# EAGLE design 1LD-15-mk-1.0 (EAGLE 7.5.0)
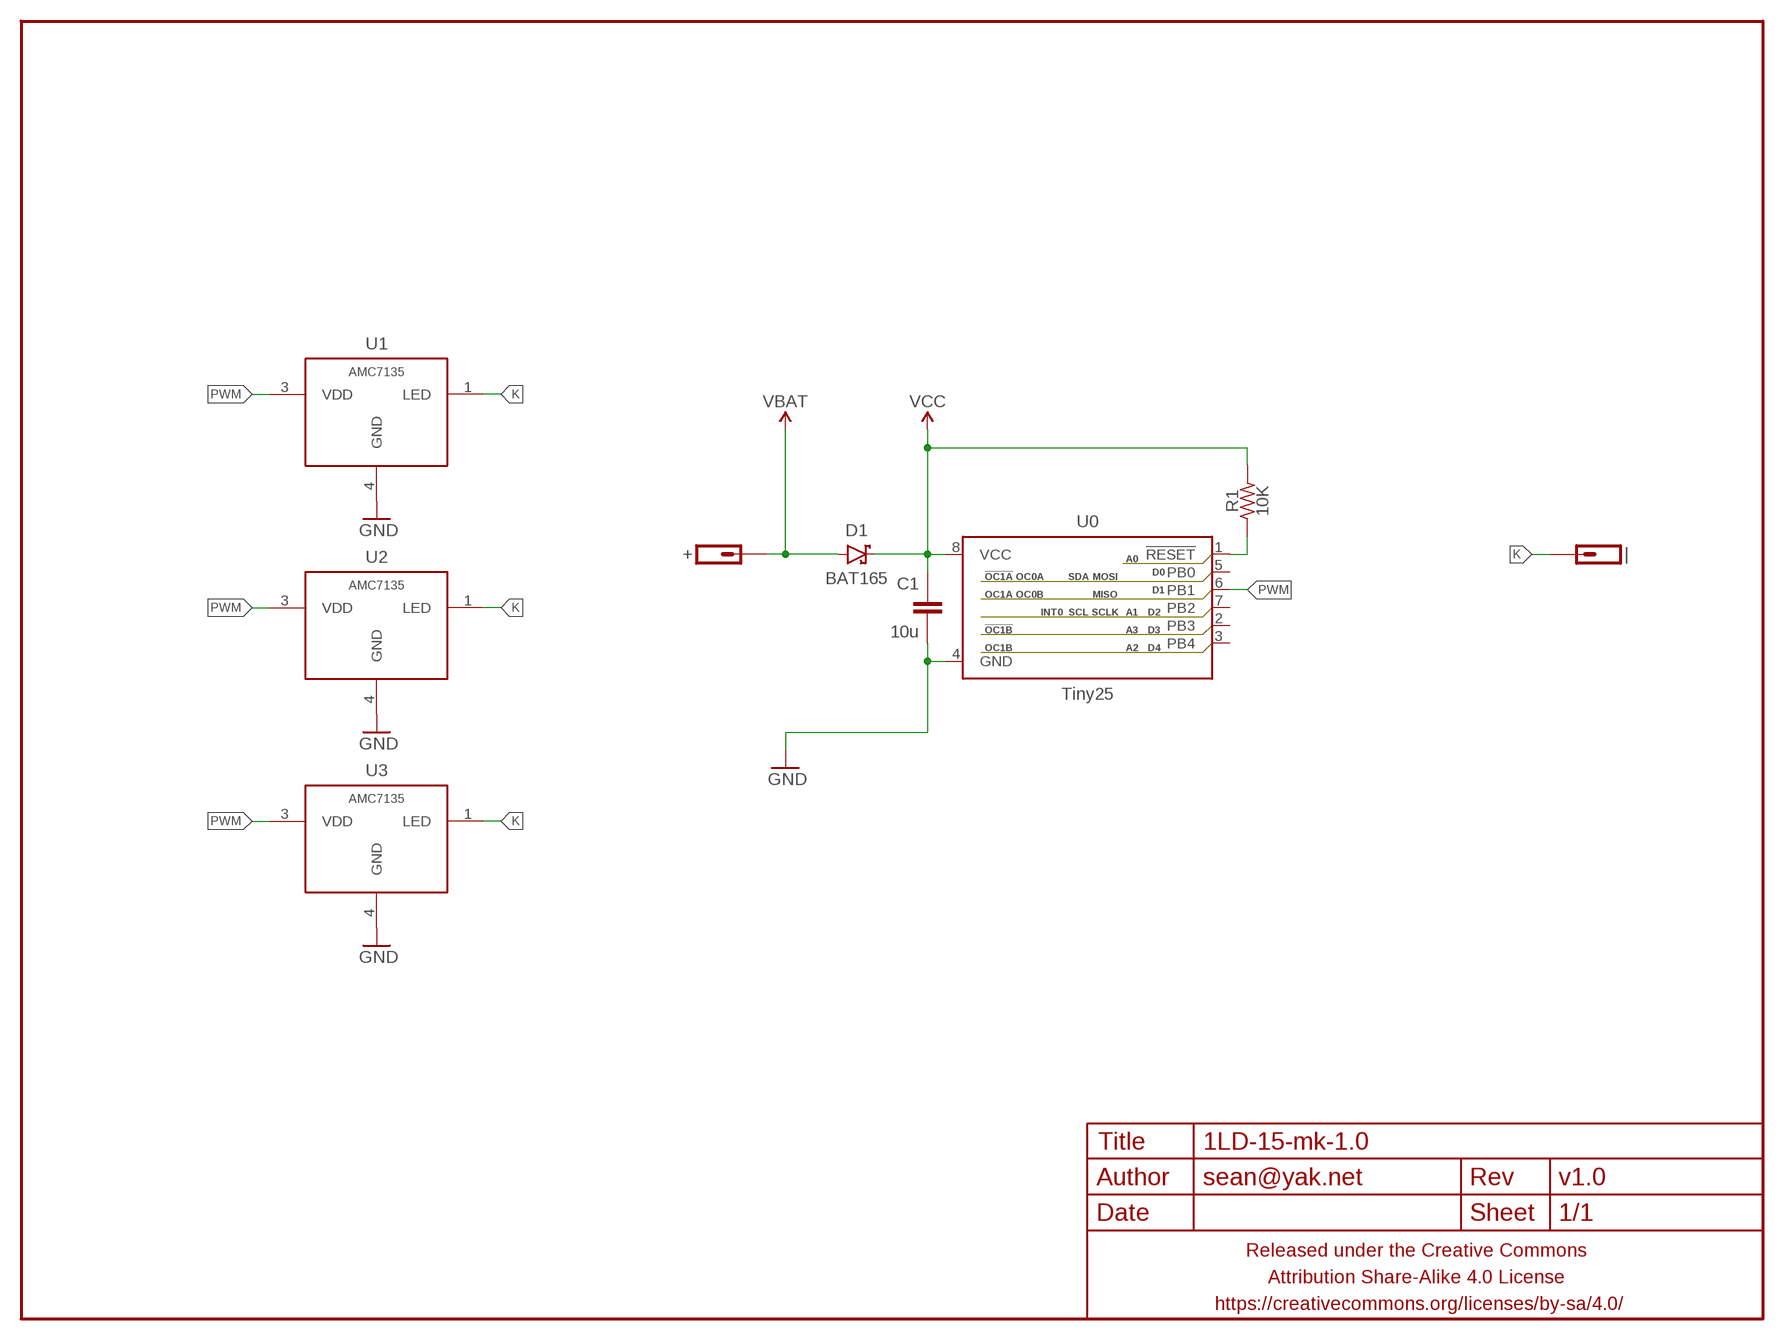
[diagram p0: schematic, sheet 1]

## Parts
+  M01PTH-0.8MM-CIR  [1X01-0.8MM-CIR]
C1  10u  CAPACITOR-CERAMICC0603-TIGHTER  [C0603-TIGHTER]
D1  BAT165  DIODE-SCHOTTKYSOD123-ROUNDED  [SOD-123-SCHOTTYK-ROUND]
FRAME1  FRAME-LETTERNO_PACKAGE  [DUMMY]
R1  10K  RESISTORR0603-TIGHTER  [R0603-TIGHTER]
U0  Tiny25  ATTINY13SOIC-NARROWPADS  [SO08-NARROWER]
U1  AMC7135  AMC7135SOT-89-NOTHERM-ROUNDED-LESS  [SOT89-NOTHERM-ROUNDED-LESS]
U2  AMC7135  AMC7135SOT-89-NOTHERM-ROUNDED-LESS  [SOT89-NOTHERM-ROUNDED-LESS]
U3  AMC7135  AMC7135SOT-89-NOTHERM-ROUNDED-LESS  [SOT89-NOTHERM-ROUNDED-LESS]
|  M01PTH-0.8MM-CIR  [1X01-0.8MM-CIR]

## Nets
GND: C1.2 U0.4(GND) U1.4(GND) U2.4(GND) U3.4(GND)
K: U1.1(LED) U2.1(LED) U3.1(LED) |.1
N$1: R1.1 U0.1(!RESET)
PWM: U0.6(PB1) U1.3(VDD) U2.3(VDD) U3.3(VDD)
VBAT: +.1 D1.A
VCC: C1.1 D1.C R1.2 U0.8(VCC)
Unconnected: U0.2(PB3) U0.3(PB4) U0.5(PB0) U0.7(PB2)

## Library data of the parts
+ | = a_parts:M01: Header 1 Standard 1-pin 0.1" header. Use with straight break away headers (SKU : PRT-00116), right angle break away headers (PRT-00553), swiss pins (PRT-00743), machine pins (PRT-00117), and female headers (PRT-00115).
C1 = a_parts:CAPACITOR-CERAMIC: CAPACITOR, European symbol
D1 = a_parts:DIODE-SCHOTTKY: Schottky diodes in SFE's production catalog BAT20J 1A 23V 0.62Vf RB751 120mA 40V 0.37Vf PMEG4005EJ 0.5A 40V 0.42Vf MBRA140 1A 40V 0.5Vf B340A 3A 40V SMA
FRAME1 = a_parts:FRAME-LETTER: Schematic Frame Standard 8.5x11 US Letter frame; DESIGNER: sean@yak.net; VERSION: v1.0
R1 = a_parts:RESISTOR: RESISTOR, American symbol
U0 = a_parts:ATTINY13: Atmel 8-pin 1kB flash uC
U1-U3 = a_parts:AMC7135

## Board
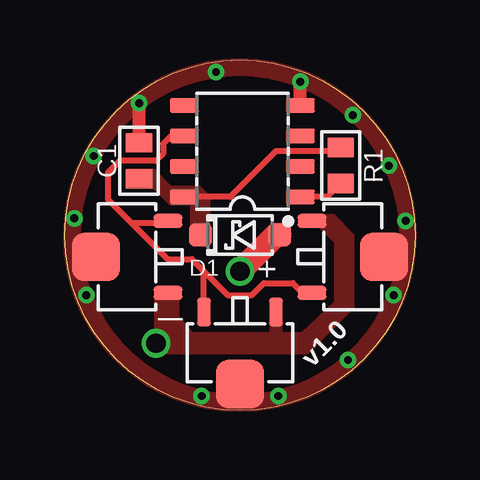
[diagram p1: board, top side]
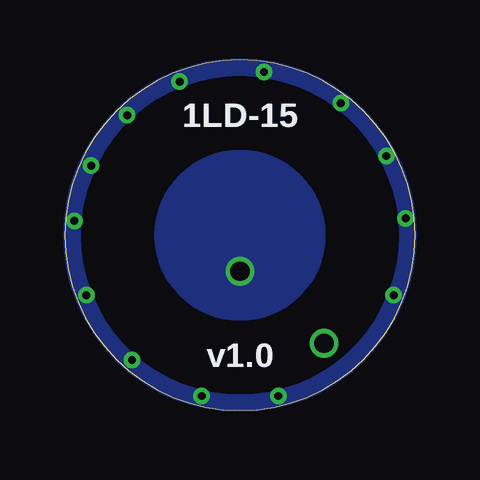
[diagram p2: board, bottom side, seen from below]

Size 14.6 x 14.6 mm. Coordinates in mm from the lower left corner, seen from the top.
Outline: 0,7.3 arc-180 14.6,7.3 arc-180 0,7.3
Copper layers (1*16): Top 0.0356mm / dielectric 1.5011mm / Bottom 0.0356mm
Design rules "LaenPCBOrder2 *": minimum track width 6mil, minimum drill 13mil, track to track 6mil, track to pad 6mil, pad to pad 6mil, via to via 6mil, smd to smd 6mil, copper to edge 0mil, drill to drill 6mil, minimum pad ring 7mil, minimum via ring 7mil, stop-mask expansion 3mil, vias tented up to drill 20mil, thermal gap 10mil

### Footprints (pad centres in the part's own frame; a part is rotated, then mirrored left to right if it is on the bottom)
1X01-0.8MM-CIR = drill 0.8: 1 0,0
C0603-TIGHTER = smd 0.8 x 1.1: 1 -0.75,0; 2 0.75,0
SOD-123-SCHOTTYK-ROUND = smd 0.95 x 0.95: A -1.65,0; C 1.65,0
R0603-TIGHTER = smd 0.8 x 1.1: 1 -0.75,0; 2 0.75,0
SO08-NARROWER = smd 0.6 x 1.2: 1 -1.905,-2.416; 2 -0.635,-2.416; 3 0.635,-2.416; 4 1.905,-2.416; 5 1.905,2.416; 6 0.635,2.416; 7 -0.635,2.416; 8 -1.905,2.416
SOT89-NOTHERM-ROUNDED-LESS = smd 0.58 x 1.2: 1 -1.5,-1.7; 3 1.5,-1.7 | smd 2 x 2: 4 0,1.3

### Placement (x,y rotation side)
+  7.3,5.8 90 top
C1  3.1,10.4 90 top
D1  7.3,7.3 180 top
FRAME1  -0.2,-0.2 0 top
R1  11.5,10.2 90 top
U0  7.4,10.8 90 top
U1  2.6,6.4 90 top
U2  7.3,2.4 180 top
U3  12,6.4 270 top
|  3.8,2.8 270 top

### Tracks (layer width: path | path; a pad name or v marks a point on that pad's centre or on a via)
GND  (via drill 0.33)
  Top 0.55: U0.4 v9.82,13.7 | C1.2 v3.1,12.8
  other vias: 5.7,0.6 0.4,8 14.2,7.9 0.9,4.8 8.9,0.6 13.7,4.8 6.3,14.1 1.2,10.6 11.8,2.1 13.5,10.2 12,12.3
  pour Bottom (isolate 0.152, rank 2, no thermals): 0,7.3 0.6,7.3 arc-90 7.3,14 arc-90 14,7.3 14.6,7.3 arc90 7.3,14.6 arc90
  pour Top (isolate 0.152, no thermals): 14.6,7.3 14,7.3 arc90 7.3,14 arc90 0.6,7.3 0,7.3 arc-90 7.3,14.6 arc-90
  pour Bottom (isolate 0.152, rank 2, no thermals): 14.6,7.3 14,7.3 arc-90 7.3,0.6 arc-90 0.6,7.3 0,7.3 arc90 7.3,0 arc90
  pour Top (isolate 0.152, no thermals): 0,7.3 0.6,7.3 arc90 7.3,0.6 arc90 14,7.3 14.6,7.3 arc-90 7.3,0 arc-91
K
  pour Top (isolate 0.152, no thermals): 3.8,5 3.8,3.3 arc90 3.3,2.8 arc90 3.8,2.3 arc90 4.3,2.8 4.3,2.4 10.1,2.4 12,4.3 12,7.3 11.2,8.1 9.9,8.1 9.9,7.7 10.6,7.7 11.3,7 11.3,4.5 9.9,3.2 9,3.2 9,4.3 8.6,4.3 8.6,3.2 5.3,3.2 4.7,3.9 4.7,4.9 4.6,5
N$1
  Top 0.25: R1.1 10.95,8.89 U0.1
PWM
  Top 0.25: U0.6 4.43,11.43 4.1,11.1 4.1,10.7 3.8,10.4 2.3,10.4 1.8,9.9 1.8,8.8 2.8,7.8 | 2.8,7.8 4.3,6.3 5.3,6.3 5.8,5.8 | 5.8,5.8 6.8,4.8 7.8,4.8 8.3,5.3 9.5,5.3 9.9,4.9 U3.3 | U1.3 4.2,7.8 2.8,7.8 | U2.3 5.8,5.8
VBAT
  Top 1: +.1 8.8,7.3 D1.A
  pour Bottom (isolate 0.152, no thermals): 3.8,7.3 arc-180 10.8,7.3 arc-180
VCC
  Top 0.25: R1.2 11.35,10.8 8.8,10.8 6.89,8.89 U0.8
  pour Top (isolate 0.152, no thermals): 2.6,10 3.7,10 4.4,9.3 5.6,9.3 6,8.9 6,7 5.3,7 5.3,8.6 4.4,8.6 3.7,9.3 2.6,9.3

### Text on the board
Bottom: 1LD-15
bPlace: 1LD-15